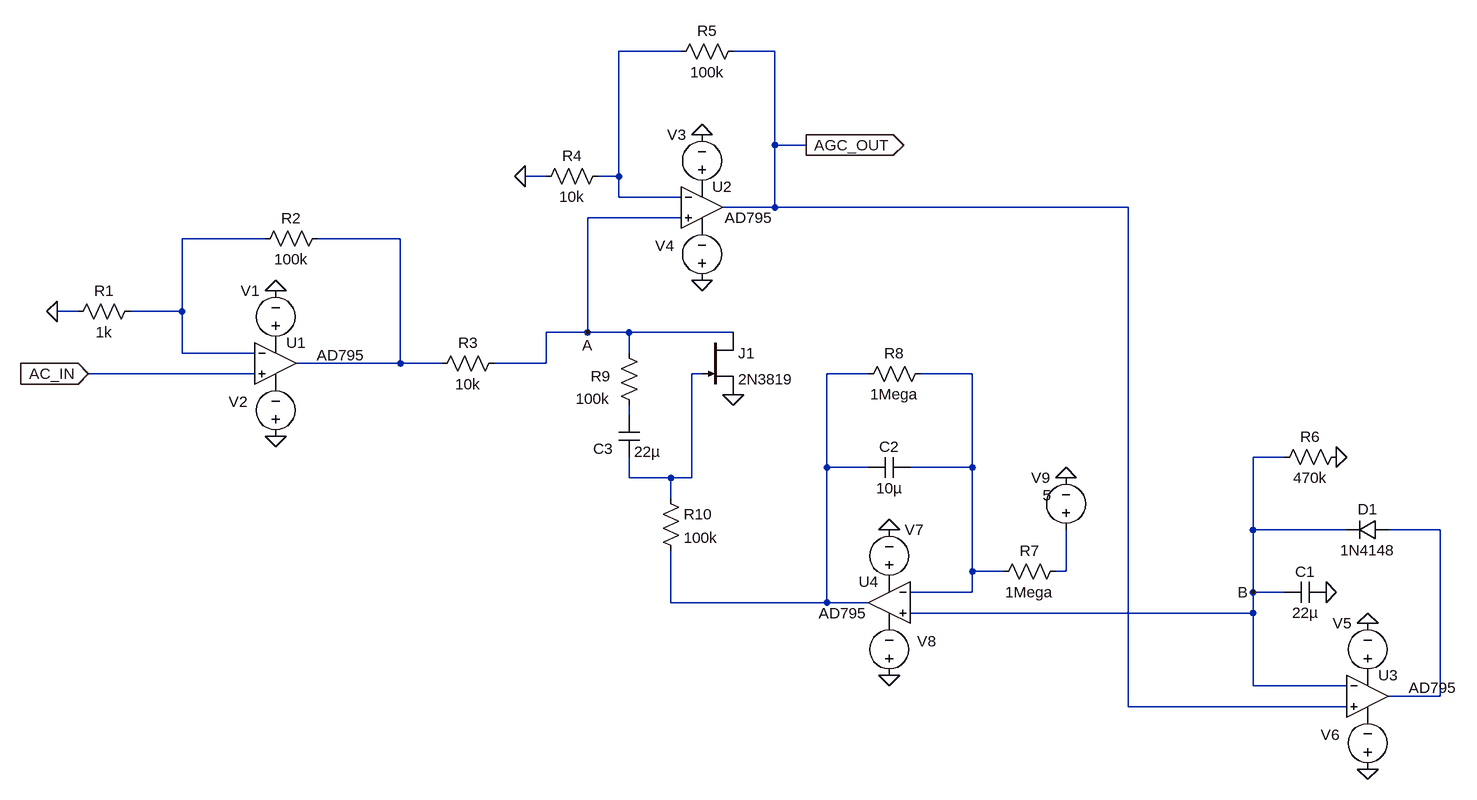
[diagram p0: schematic AGC.asc]
AGC.asc, the LTspice schematic file:
Version 4.1
SHEET 1 1792 820
WIRE 592 -304 496 -304
WIRE 736 -304 672 -304
WIRE 736 -160 736 -304
WIRE 784 -160 736 -160
WIRE 384 -112 352 -112
WIRE 496 -112 496 -304
WIRE 496 -112 464 -112
WIRE 496 -80 496 -112
WIRE 592 -80 496 -80
WIRE 736 -64 736 -160
WIRE 736 -64 656 -64
WIRE 1280 -64 736 -64
WIRE 592 -48 448 -48
WIRE -48 -16 -176 -16
WIRE 160 -16 32 -16
WIRE -336 96 -368 96
WIRE -176 96 -176 -16
WIRE -176 96 -256 96
WIRE 448 128 448 -48
WIRE 448 128 384 128
WIRE 512 128 448 128
WIRE 672 128 512 128
WIRE -176 160 -176 96
WIRE -64 160 -176 160
WIRE 512 160 512 128
WIRE 160 176 160 -16
WIRE 160 176 0 176
WIRE 224 176 160 176
WIRE 384 176 384 128
WIRE 384 176 304 176
WIRE -64 192 -320 192
WIRE 624 192 608 192
WIRE 880 192 816 192
WIRE 1040 192 960 192
WIRE 512 256 512 240
WIRE 1520 320 1472 320
WIRE 816 336 816 192
WIRE 880 336 816 336
WIRE 1040 336 1040 192
WIRE 1040 336 944 336
WIRE 512 352 512 320
WIRE 576 352 512 352
WIRE 608 352 608 192
WIRE 608 352 576 352
WIRE 576 384 576 352
WIRE 1472 432 1472 320
WIRE 1616 432 1472 432
WIRE 1760 432 1680 432
WIRE 1040 496 1040 336
WIRE 1088 496 1040 496
WIRE 1184 496 1184 432
WIRE 1184 496 1168 496
WIRE 1040 528 1040 496
WIRE 1040 528 944 528
WIRE 1472 528 1472 432
WIRE 1520 528 1472 528
WIRE 576 544 576 464
WIRE 816 544 816 336
WIRE 816 544 576 544
WIRE 880 544 816 544
WIRE 1472 560 1472 528
WIRE 1472 560 944 560
WIRE 1472 672 1472 560
WIRE 1616 672 1472 672
WIRE 1760 688 1760 432
WIRE 1760 688 1680 688
WIRE 1280 704 1280 -64
WIRE 1616 704 1280 704
FLAG -368 96 0
FLAG 784 -160 AGC_OUT
IOPIN 784 -160 Out
FLAG -32 288 0
FLAG -32 64 0
FLAG 672 224 0
FLAG 624 48 0
FLAG 624 -176 0
FLAG 352 -112 0
FLAG 1648 800 0
FLAG 1648 576 0
FLAG 1600 320 0
FLAG 1584 528 0
FLAG 912 656 0
FLAG 912 432 0
FLAG 1184 352 0
FLAG 448 128 A
FLAG 1472 528 B
FLAG -320 192 AC_IN
IOPIN -320 192 In
SYMBOL OpAmps\\AD795 -32 112 R0
WINDOW 3 63 51 Left 2
SYMATTR InstName U1
SYMBOL res -240 80 R90
WINDOW 0 0 56 VBottom 2
WINDOW 3 32 56 VTop 2
SYMATTR InstName R1
SYMATTR Value 1k
SYMBOL res 48 -32 R90
WINDOW 0 0 56 VBottom 2
WINDOW 3 32 56 VTop 2
SYMATTR InstName R2
SYMATTR Value 100k
SYMBOL voltage -32 160 R180
WINDOW 0 24 96 Left 2
WINDOW 3 24 16 Invisible 2
WINDOW 123 0 0 Left 0
WINDOW 39 0 0 Left 0
SYMATTR InstName V1
SYMATTR Value 15
SYMBOL voltage -32 304 R180
WINDOW 0 43 69 Left 2
WINDOW 3 24 96 Invisible 2
WINDOW 123 0 0 Left 0
WINDOW 39 0 0 Left 0
SYMATTR InstName V2
SYMATTR Value 15
SYMBOL njf 624 128 R0
SYMATTR InstName J1
SYMATTR Value 2N3819
SYMBOL res 320 160 R90
WINDOW 0 0 56 VBottom 2
WINDOW 3 32 56 VTop 2
SYMATTR InstName R3
SYMATTR Value 10k
SYMBOL OpAmps\\AD795 624 -128 R0
WINDOW 3 35 80 Left 2
SYMATTR InstName U2
SYMBOL voltage 624 -80 R180
WINDOW 0 24 96 Left 2
WINDOW 3 24 16 Invisible 2
WINDOW 123 0 0 Left 0
WINDOW 39 0 0 Left 0
SYMATTR InstName V3
SYMATTR Value 15
SYMBOL voltage 624 64 R180
WINDOW 0 43 69 Left 2
WINDOW 3 24 96 Invisible 2
WINDOW 123 0 0 Left 0
WINDOW 39 0 0 Left 0
SYMATTR InstName V4
SYMATTR Value 15
SYMBOL res 480 -128 R90
WINDOW 0 0 56 VBottom 2
WINDOW 3 32 56 VTop 2
SYMATTR InstName R4
SYMATTR Value 10k
SYMBOL res 688 -320 R90
WINDOW 0 0 56 VBottom 2
WINDOW 3 32 56 VTop 2
SYMATTR InstName R5
SYMATTR Value 100k
SYMBOL OpAmps\\AD795 1648 624 R0
WINDOW 3 63 51 Left 2
SYMATTR InstName U3
SYMBOL voltage 1648 672 R180
WINDOW 0 24 96 Left 2
WINDOW 3 24 16 Invisible 2
WINDOW 123 0 0 Left 0
WINDOW 39 0 0 Left 0
SYMATTR InstName V5
SYMATTR Value 15
SYMBOL voltage 1648 816 R180
WINDOW 0 43 69 Left 2
WINDOW 3 24 96 Invisible 2
WINDOW 123 0 0 Left 0
WINDOW 39 0 0 Left 0
SYMATTR InstName V6
SYMATTR Value 15
SYMBOL diode 1680 416 R90
WINDOW 0 0 32 VBottom 2
WINDOW 3 32 32 VTop 2
SYMATTR InstName D1
SYMATTR Value 1N4148
SYMBOL cap 1584 512 R90
WINDOW 0 0 32 VBottom 2
WINDOW 3 32 32 VTop 2
SYMATTR InstName C1
SYMATTR Value 22µ
SYMBOL res 1616 304 R90
WINDOW 0 0 56 VBottom 2
WINDOW 3 32 56 VTop 2
SYMATTR InstName R6
SYMATTR Value 470k
SYMBOL OpAmps\\AD795 912 480 M0
WINDOW 3 35 80 Left 2
SYMATTR InstName U4
SYMBOL voltage 912 528 M180
WINDOW 0 24 96 Left 2
WINDOW 3 24 16 Invisible 2
WINDOW 123 0 0 Left 0
WINDOW 39 0 0 Left 0
SYMATTR InstName V7
SYMATTR Value 15
SYMBOL voltage 912 672 M180
WINDOW 0 43 69 Left 2
WINDOW 3 24 96 Invisible 2
WINDOW 123 0 0 Left 0
WINDOW 39 0 0 Left 0
SYMATTR InstName V8
SYMATTR Value 15
SYMBOL voltage 1184 448 R180
WINDOW 0 24 96 Left 2
WINDOW 3 22 69 Left 2
WINDOW 123 0 0 Left 0
WINDOW 39 0 0 Left 0
SYMATTR InstName V9
SYMATTR Value 5
SYMBOL res 1184 480 R90
WINDOW 0 0 56 VBottom 2
WINDOW 3 32 56 VTop 2
SYMATTR InstName R7
SYMATTR Value 1Mega
SYMBOL cap 944 320 R90
WINDOW 0 0 32 VBottom 2
WINDOW 3 32 32 VTop 2
SYMATTR InstName C2
SYMATTR Value 10µ
SYMBOL res 976 176 R90
WINDOW 0 0 56 VBottom 2
WINDOW 3 32 56 VTop 2
SYMATTR InstName R8
SYMATTR Value 1Mega
SYMBOL res 496 144 R0
WINDOW 0 -43 52 Left 2
WINDOW 3 -66 86 Left 2
SYMATTR InstName R9
SYMATTR Value 100k
SYMBOL res 560 368 R0
SYMATTR InstName R10
SYMATTR Value 100k
SYMBOL cap 496 256 R0
WINDOW 0 -39 51 Left 2
SYMATTR InstName C3
SYMATTR Value 22µ

The netlist it stands for:
* AGC.asc
X§U1 AC_IN N002 P001 P002 N003 AD795  ; pins In+ In- V+ V- OUT
R1 N002 0 1k
R2 N003 N002 100k
V1 P001 0 15
V2 0 P002 15
J1 A N004 0 2N3819
R3 A N003 10k
X§U2 A N001 P003 P004 AGC_OUT AD795  ; pins In+ In- V+ V- OUT
V3 P003 0 15
V4 0 P004 15
R4 N001 0 10k
R5 AGC_OUT N001 100k
X§U3 AGC_OUT B P005 P006 N008 AD795  ; pins In+ In- V+ V- OUT
V5 P005 0 15
V6 0 P006 15
D1 N008 B 1N4148
C1 0 B 22µ
R6 0 B 470k
X§U4 B N006 P007 P008 N005 AD795  ; pins In+ In- V+ V- OUT
V7 P007 0 15
V8 0 P008 15
V9 N009 0 5
R7 N009 N006 1Mega
C2 N006 N005 10µ
R8 N006 N005 1Mega
R9 A N007 100k
R10 N004 N005 100k
C3 N007 N004 22µ
.model D D
.lib standard.dio
.model NJF NJF
.model PJF PJF
.lib standard.jft
.lib ADI1.lib
.backanno
.end